# Altium schematic sheet STM32F103C8T6.SchDoc
size A4; SheetNumber: 0; SheetTotal: 0
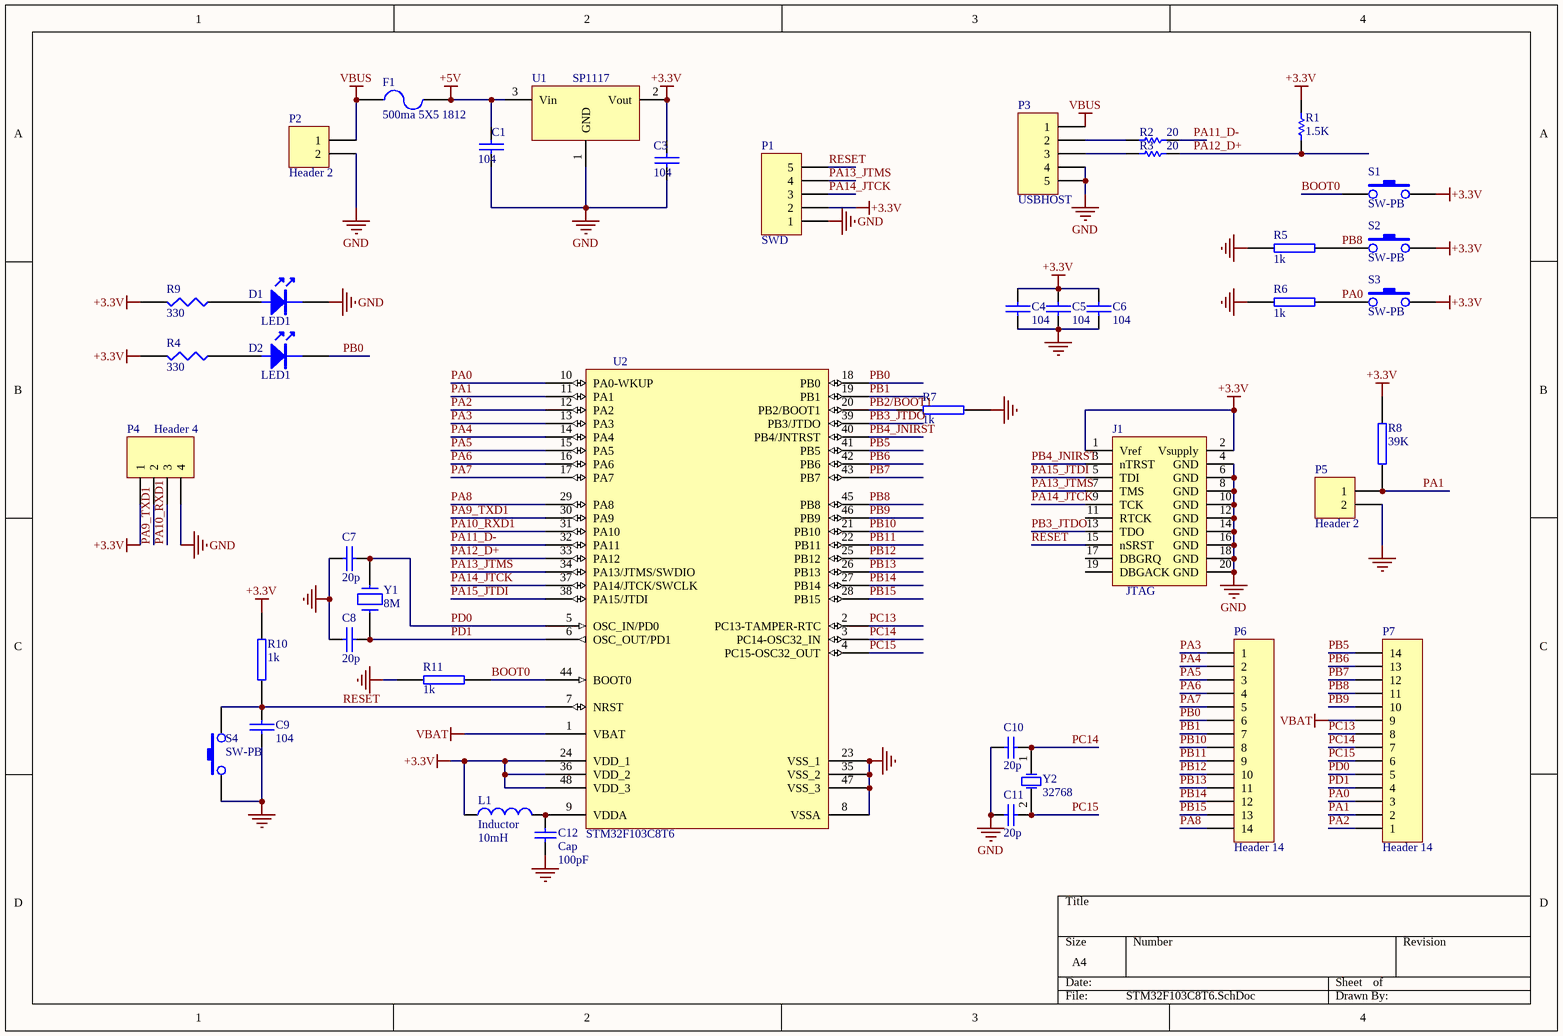
[diagram p0: STM32F103C8T6.SchDoc]

## Parts
C1  104  [0805C1]
C3  104  [0805C1]
C4  104  [0805C1]
C5  104  [0805C1]
C6  104  [0805C1]
C7  20p  [0805C1]
C8  20p  [0805C1]
C9  104  [0805C1]
C10  value 20p  [0805C1]  (hidden comment: Cap)
C11  value 20p  [0805C1]  (hidden comment: Cap)
C12  Cap  value 100pF  [0805C1]
D1  LED1  [0805LED]
D2  LED1  [0805LED]
F1  500ma 5X5 1812  [1812R]
J1  JTAG  [HDR2X10]
L1  Inductor  value 10mH  [0805R1]
P1  SWD  [HDR1X5]
P2  Header 2  [5VINPUT]
P3  USBHOST  [USB_mini]
P4  Header 4  [HDR1X4]
P5  Header 2  [HDR1X2]
P6  Header 14  [HDR1X14]
P7  Header 14  [HDR1X14]
R1  value 1.5K  [0805R1]  (hidden comment: Res Semi)
R2  value 20  [0805R1]  (hidden comment: Res Semi)
R3  value 20  [0805R1]  (hidden comment: Res Semi)
R4  330  [0805R1]
R5  1k  [0805R1]
R6  1k  [0805R1]
R7  1k  [0805R1]
R8  39K  [0805R1]
R9  330  [0805R1]
R10  1k  [0805R1]
R11  1k  [0805R1]
S1  SW-PB  [KEY_5*5*X]
S2  SW-PB  [KEY_5*5*X]
S3  SW-PB  [KEY_5*5*X]
S4  SW-PB  [KEY_5*5*X]
U1  SP1117  [SOT-223]
U2  STM32F103C8T6  [LQFP48_M]
Y1  8M  [XTAL_smd1]
Y2  32768  [XTAL_32768_HH]

## Nets
+3.3V: C3.1 C4.2 C5.2 C6.2 J1.1(Vref) J1.2(Vsupply) L1.1 P1.2 P4.1 R1.1 R4.2 R8.1 R9.2 R10.2 S1.2 S2.1 S3.1 U1.2(Vout) U2.24(VDD_1) U2.36(VDD_2) U2.48(VDD_3)
+5V: C1.1 F1.2 U1.3(Vin)
GND: C1.2 C3.2 C4.1 C5.1 C6.1 C7.1 C8.1 C9.1 C10.2 C11.2 C12.1 D1.2 J1.4(GND) J1.6(GND) J1.8(GND) J1.10(GND) J1.12(GND) J1.14(GND) J1.16(GND) J1.18(GND) J1.20(GND) P1.1 P2.2 P3.4 P3.5 P4.4 P5.2 R5.2 R6.2 R7.2 R11.2 S4.1 U1.1(GND) U2.8(VSSA) U2.23(VSS_1) U2.35(VSS_2) U2.47(VSS_3)
VBAT: P7.9 U2.1(VBAT)
VBUS: F1.1 P2.1 P3.1
BOOT0: R11.1 S1.1 U2.44(BOOT0)
PA0: P7.3 R6.1 S3.2 U2.10(PA0-WKUP)
PA1: P5.1 P7.2 R8.2 U2.11(PA1)
PA2: P7.1 U2.12(PA2)
PA3: P6.1 U2.13(PA3)
PA4: P6.2 U2.14(PA4)
PA5: P6.3 U2.15(PA5)
PA6: P6.4 U2.16(PA6)
PA7: P6.5 U2.17(PA7)
PA8: P6.14 U2.29(PA8)
PA9_TXD1: P4.2 U2.30(PA9)
PA10_RXD1: P4.3 U2.31(PA10)
PA11_D-: R2.2 U2.32(PA11)
PA12_D+: R1.2 R3.2 U2.33(PA12)
PA13_JTMS: J1.7(TMS) P1.4 U2.34(PA13/JTMS/SWDIO)
PA14_JTCK: J1.9(TCK) P1.3 U2.37(PA14/JTCK/SWCLK)
PA15_JTDI: J1.5(TDI) U2.38(PA15/JTDI)
PB0: D2.2 P6.6 U2.18(PB0)
PB1: P6.7 U2.19(PB1)
PB2/BOOT1: R7.1 U2.20(PB2/BOOT1)
PB3_JTDO: J1.13(TDO) U2.39(PB3/JTDO)
PB4_JNIRST: J1.3(nTRST) U2.40(PB4/JNTRST)
PB5: P7.14 U2.41(PB5)
PB6: P7.13 U2.42(PB6)
PB7: P7.12 U2.43(PB7)
PB8: P7.11 R5.1 S2.2 U2.45(PB8)
PB9: P7.10 U2.46(PB9)
PB10: P6.8 U2.21(PB10)
PB11: P6.9 U2.22(PB11)
PB12: P6.10 U2.25(PB12)
PB13: P6.11 U2.26(PB13)
PB14: P6.12 U2.27(PB14)
PB15: P6.13 U2.28(PB15)
PC13: P7.8 U2.2(PC13-TAMPER-RTC)
PC14: C10.1 P7.7 U2.3(PC14-OSC32_IN) Y2.1(OSC1)
PC15: C11.1 P7.6 U2.4(PC15-OSC32_OUT) Y2.2(OSC2)
PD0: C7.2 P7.5 U2.5(OSC_IN/PD0) Y1.1
PD1: C8.2 P7.4 U2.6(OSC_OUT/PD1) Y1.2
RESET: C9.2 J1.15(nSRST) P1.5 R10.1 S4.2 U2.7(NRST)
NetC12_2: C12.2 L1.2 U2.9(VDDA)
NetD1_1: D1.1 R9.1
NetD2_1: D2.1 R4.1
NetP3_2: P3.2 R2.1
NetP3_3: P3.3 R3.1

Not connected (* = marked no-connect by the designer): J1 11(RTCK) 17(DBGRQ) 19(DBGACK)

## Library data of the parts
C1 C3-C9 = CAP: Capacitor
C10-C12 = Cap: Capacitor; Published: 8-Jun-2000; LatestRevisionDate: 17-Jul-2002; LatestRevisionNote: Re-released for DXP Platform.; PackageReference: RAD-0.3; Publisher: Altium Limited
  C12: PackageDescription: Radial Cap, Thru-Hole; 2 Leads; 0.3 in Pin Spacing
D1 D2 = LED
F1 = Fuse 2: Fuse; Published: 8-Jun-2000; LatestRevisionDate: 17-Jul-2002; LatestRevisionNote: Re-released for DXP Platform.; PackageReference: PIN-W2/E2.8; Publisher: Altium Limited; PackageDescription: Thru-Hole; 2 Leads
L1 = Inductor: Code_IEC: 1005; Published: 8-Jun-2000; LatestRevisionDate: 29-May-2009; LatestRevisionNote: IPC-7351 Footprint Added.; PackageReference: 0402-A; Publisher: Altium Limited; PackageDescription: Chip Inductor; Code_JEITA: 0402
P1 P3 = Header 5: Header, 5-Pin; LatestRevisionDate: 17-Jul-2002; LatestRevisionNote: Re-released for DXP Platform.; Publisher: Altium Limited
P2 P5 = Header 2: Header, 2-Pin; LatestRevisionDate: 17-Jul-2002; LatestRevisionNote: Re-released for DXP Platform.; Publisher: Altium Limited
P4 = Header 4: Header, 4-Pin; LatestRevisionDate: 17-Jul-2002; LatestRevisionNote: Re-released for DXP Platform.; Publisher: Altium Limited
P6 P7 = Header 14: Header, 14-Pin; LatestRevisionDate: 17-Jul-2002; LatestRevisionNote: Re-released for DXP Platform.; Publisher: Altium Limited
R1-R3 = Res Semi: Semiconductor Resistor; Published: 8-Jun-2000; LatestRevisionDate: 17-Jul-2002; LatestRevisionNote: Re-released for DXP Platform.; PackageReference: AXIAL-0.5; Publisher: Altium Limited; PackageDescription: Axial Device, Thru-Hole; 2 Leads; 0.5 in Pin Spacing
R4 R9 = RES1
R5-R8 R10 R11 = RES2
U2 = STM32F103C8T6: STM32 ARM-based 32-bit MCU with 64 Kbytes Flash, 48-pin LQFP, Industrial Temperature; Published: *; DatasheetVersion: *; PackageVersion: *; PackageReference: *; Publisher: *; PackageDescription: *; ComponentLink1Description: *; ComponentLink1URL: *; ComponentLink2Description: *; ComponentLink2URL: *
Y1 = CRYSTAL
Y2 = XTAL: Crystal Oscillator; Published: 8-Jun-2000; LatestRevisionDate: 17-Jul-2002; LatestRevisionNote: Re-released for DXP Platform.; Publisher: Altium Limited